# EAGLE design Mainboard (EAGLE 6.4)
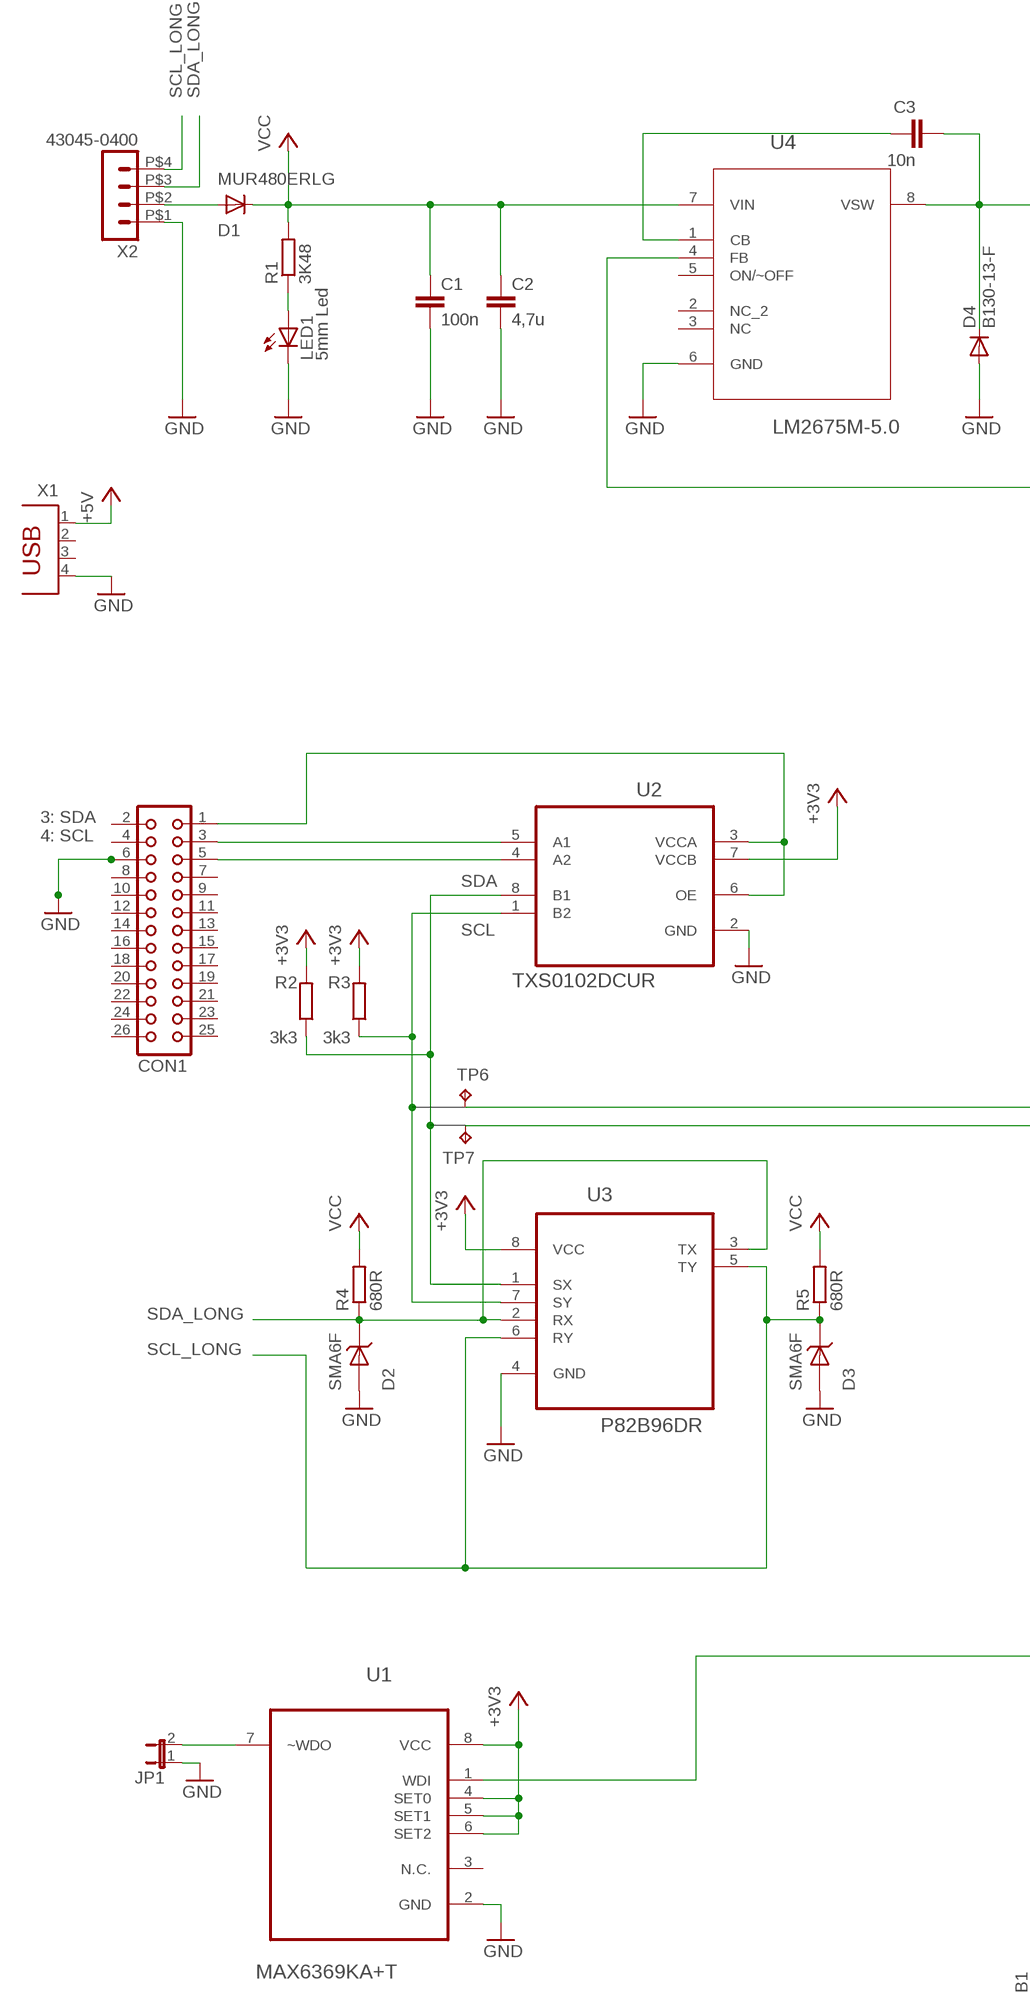
[diagram p0: schematic, sheet 1, part 1 of 2]
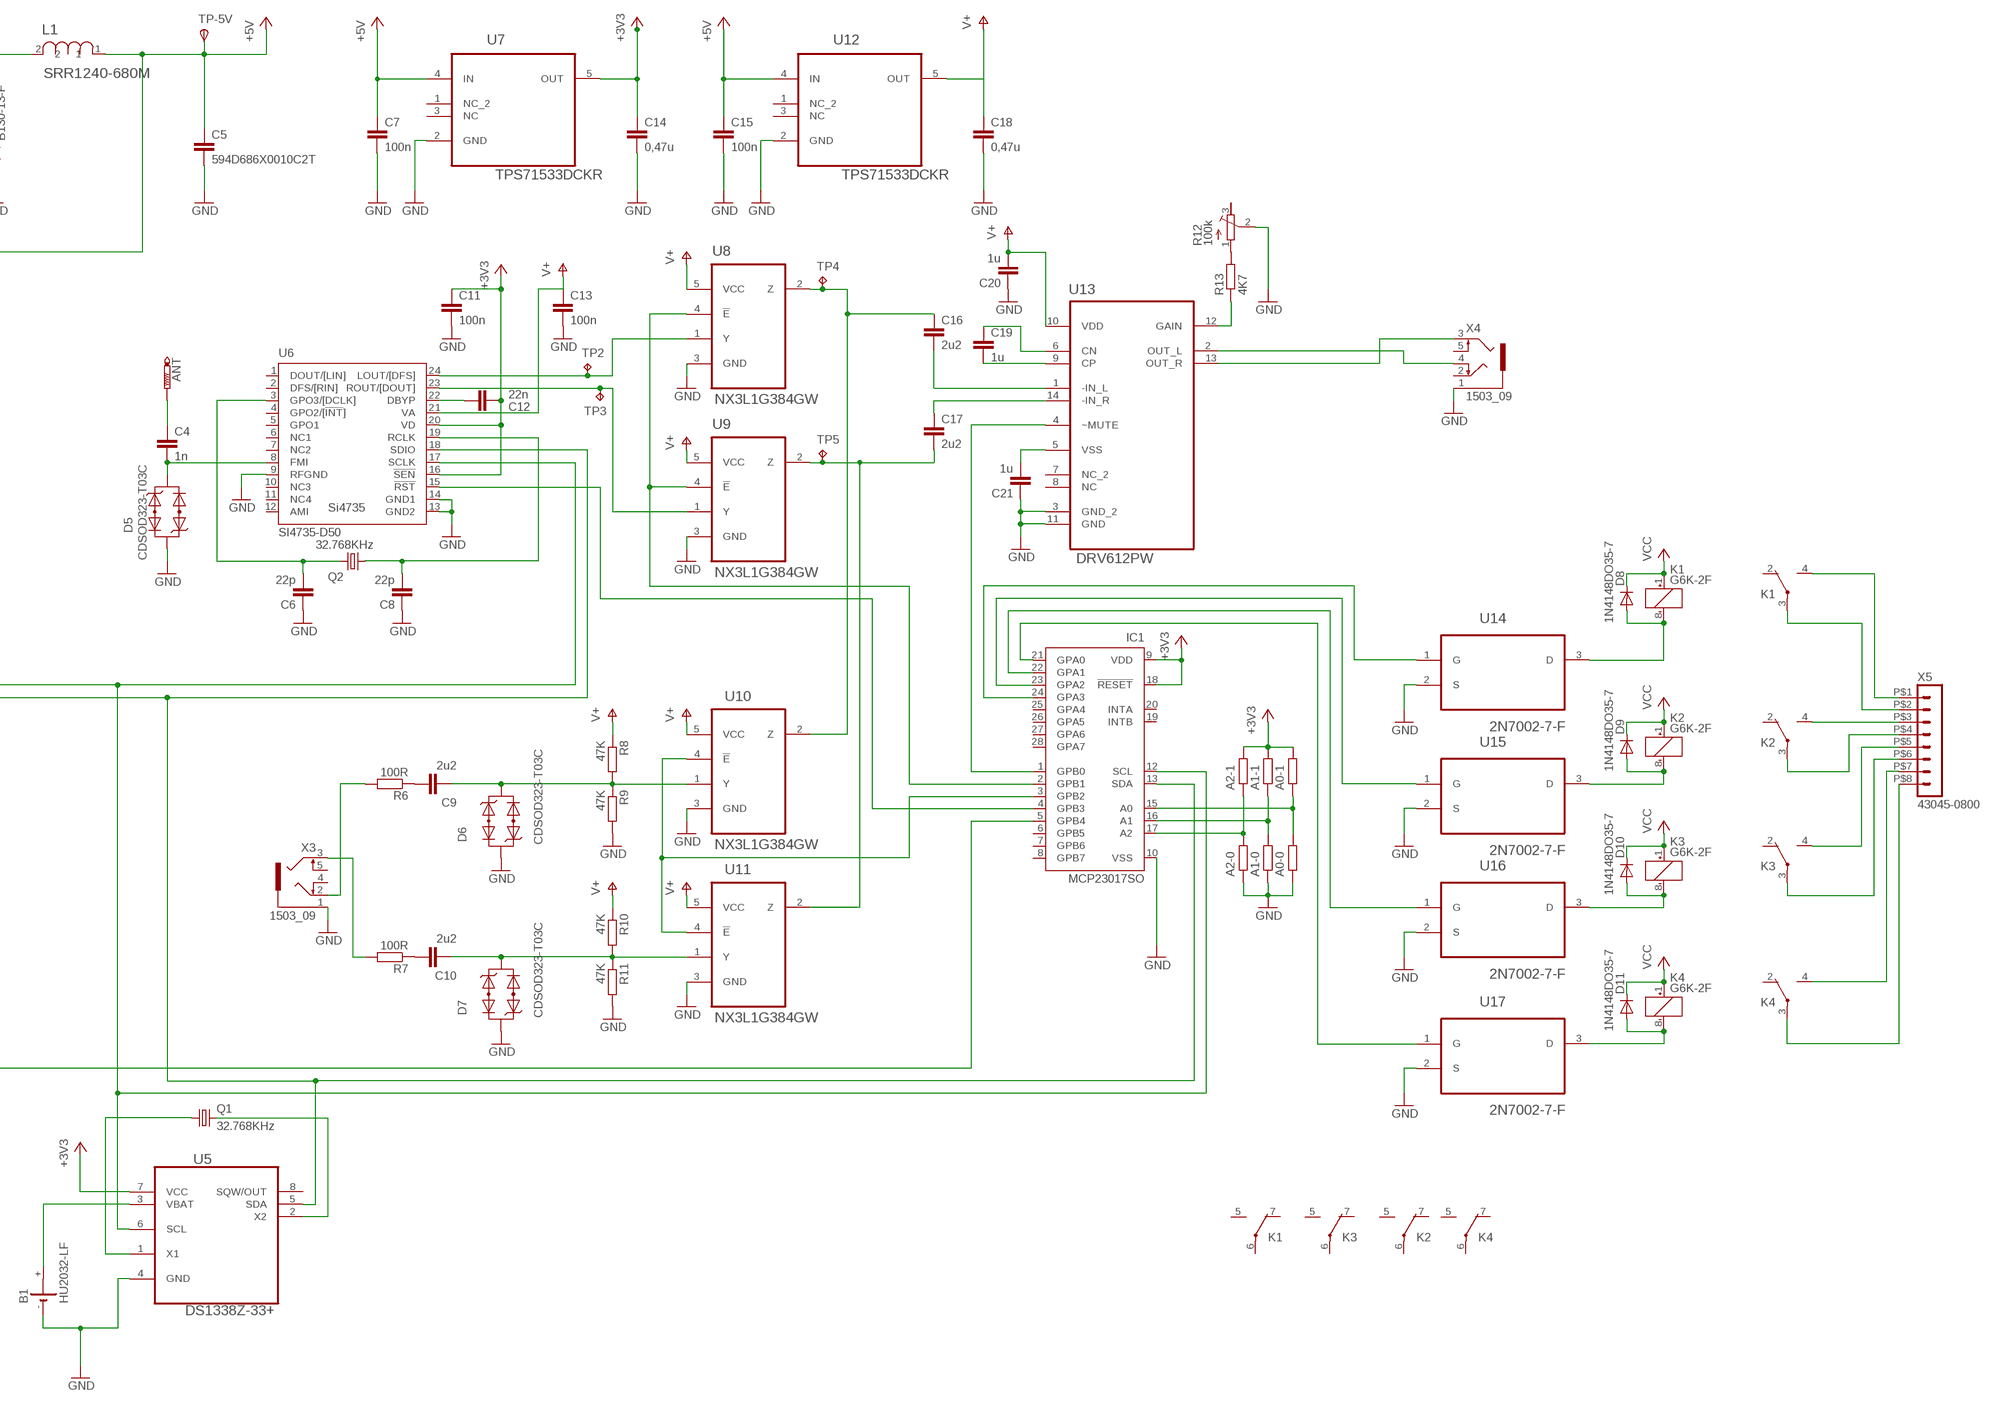
[diagram p1: schematic, sheet 1, part 2 of 2]

## Parts
ANT  PTR1PAD1-13  [P1-13]
B1  HU2032-LF  [HU2032-LF]
C1  100n  C-EUC0805  [C0805]
C2  4,7u  C-EUC1206  [C1206]
C3  10n  C-EUC0805  [C0805]
C4  1n  C-EUC0402  [C0402]
C5  594D686X0010C2T  [594D-B]
C6  22p  C-EUC0402  [C0402]
C7  100n  C-EUC0805  [C0805]
C8  22p  C-EUC0402  [C0402]
C9  2u2  C-EUC0805  [C0805]
C10  2u2  C-EUC0805  [C0805]
C11  100n  C-EUC0805  [C0805]
C12  22n  C-EUC0805  [C0805]
C13  100n  C-EUC0805  [C0805]
C14  0,47u  C-EUC0805  [C0805]
C15  100n  C-EUC0805  [C0805]
C16  2u2  C-EUC0805  [C0805]
C17  2u2  C-EUC0805  [C0805]
C18  0,47u  C-EUC0805  [C0805]
C19  1u  C-EUC1005  [C1005]
C20  1u  C-EUC1005  [C1005]
C21  1u  C-EUC1005  [C1005]
CON1  CON26  [CON26]
D1  MUR480ERLG  MUR150RL  [DO41-10]
D2  SMA6F  [DO-221AC]
D3  SMA6F  [DO-221AC]
D4  B130-13-F  DIODE-DO-214AC  [DO-214AC]
D5  CDSOD323-T03C  [SOD323]
D6  CDSOD323-T03C  [SOD323]
D7  CDSOD323-T03C  [SOD323]
D8  1N4148DO35-7  [DO35-7]
D9  1N4148DO35-7  [DO35-7]
D10  1N4148DO35-7  [DO35-7]
D11  1N4148DO35-7  [DO35-7]
IC1  MCP23017SO  [SO28W]
JP1  JP1E  [JP1]
K1  G6K-2F  [G6K-2F]
K2  G6K-2F  [G6K-2F]
K3  G6K-2F  [G6K-2F]
K4  G6K-2F  [G6K-2F]
L1  SRR1240-680M  [SRR1240]
LED1  5mm Led  LED5MM  [LED5MM]
Q1  32.768KHz  CRYSTALTC26V  [TC26V]
Q2  32.768KHz  CRYSTALTC26V  [TC26V]
R1  3K48  R-EU_0204/7  [0204/7]
R2  3k3  R-EU_0204/5  [0204/5]
R3  3k3  R-EU_0204/5  [0204/5]
R4  680R  R-EU_0204/2V  [0204V]
R5  680R  R-EU_0204/2V  [0204V]
R6  100R  R-EU_0204/2V  [0204V]
R7  100R  R-EU_0204/2V  [0204V]
R8  47K  R-EU_0204/2V  [0204V]
R9  47K  R-EU_0204/2V  [0204V]
R10  47K  R-EU_0204/2V  [0204V]
R11  47K  R-EU_0204/2V  [0204V]
R12  100k  R-TRIMM4G/J  [RTRIM4G/J]
R13  4K7  R-EU_0204/2V  [0204V]
R14  A2-1  R-EU_R0402  [R0402]
R15  A2-0  R-EU_R0402  [R0402]
R16  A1-1  R-EU_R0402  [R0402]
R17  A1-0  R-EU_R0402  [R0402]
R18  A0-1  R-EU_R0402  [R0402]
R19  A0-0  R-EU_R0402  [R0402]
TP2  TPTP07SQ  [TP07SQ]
TP3  TPTP07SQ  [TP07SQ]
TP4  TPTP07SQ  [TP07SQ]
TP5  TPTP07SQ  [TP07SQ]
TP6  TPTP07SQ  [TP07SQ]
TP7  TPTP07SQ  [TP07SQ]
TP-5V  TPSTP10SQ  [TP10SQ]
U1  MAX6369KA+T  [SOT65P280X145-8N]
U2  TXS0102DCUR  [SOP50P310X90-8N]
U3  P82B96DR  [SOIC127P600X175-8N]
U4  LM2675M-5.0  [SOIC127P620X175-8N]
U5  DS1338Z-33+  [SOIC127P600X175-8N]
U6  SI4735-D50  [SSOP24]
U7  TPS71533DCKR  [SOT65P210X110-5N]
U8  NX3L1G384GW  [SOT65P212X110-5N]
U9  NX3L1G384GW  [SOT65P212X110-5N]
U10  NX3L1G384GW  [SOT65P212X110-5N]
U11  NX3L1G384GW  [SOT65P212X110-5N]
U12  TPS71533DCKR  [SOT65P210X110-5N]
U13  DRV612PW  [SOP65P640X120-14N]
U14  2N7002-7-F  [SOT103P240X110-3N]
U15  2N7002-7-F  [SOT103P240X110-3N]
U16  2N7002-7-F  [SOT103P240X110-3N]
U17  2N7002-7-F  [SOT103P240X110-3N]
X1  PN87520  [PN87520]
X2  43045-0400  HEADER_POS4_43045-0401  [43045-0400]
X3  1503_09  [1503_09]
X4  1503_09  [1503_09]
X5  43045-0800  HEADER_POS8_43045-0800  [43045-0800]

## Nets
3V3A: C13.1 C18.1 C20.2 R8.1 R10.1 U6.21(VA) U8.5(VCC) U9.5(VCC) U10.5(VCC) U11.5(VCC) U12.5(OUT) U13.10(VDD) ; supply symbol labelled V+
+3V3 [Normal Bcc]: C11.1 C12.1 C14.1 IC1.9(VDD) IC1.18(!RESET) R2.2 R3.2 R14.2 R16.2 R18.2 U1.4(SET0) U1.5(SET1) U1.6(SET2) U1.8(VCC) U2.7(VCCB) U3.8(VCC) U5.7(VCC) U6.16(!SEN) U6.20(VD) U7.5(OUT)
+5V [Big Vcc]: C5.P$1 C7.1 C15.1 L1.1 TP-5V.TP(PP) U4.4(FB) U7.4(IN) U12.4(IN) X1.1
GND: B1.- C1.2 C2.2 C5.P$2 C6.1 C7.2 C8.1 C11.2 C13.2 C14.2 C15.2 C18.2 C20.1 C21.1 CON1.6 D2.AN D3.AN D4.A D5.P$1 D6.P$1 D7.P$1 IC1.10(VSS) JP1.1 LED1.K(C) R9.2 R11.2 R12.2(S) R15.1 R17.1 R19.1 U1.2(GND) U2.2(GND) U3.4(GND) U4.6(GND) U5.4(GND) U6.9(RFGND) U6.13(GND2) U6.14(GND1) U7.2(GND) U8.3(GND) U9.3(GND) U10.3(GND) U11.3(GND) U12.2(GND) U13.3(GND_2) U13.11(GND) U14.2(S) U15.2(S) U16.2(S) U17.2(S) X1.4 X2.P$1 X3.1 X4.1
N$1 [Big Vcc]: D1.A X2.P$2
N$2: C6.2 Q2.1 U6.3(GPO3/[DCLK])
N$3: CON1.3 U2.5(A1)
N$4: IC1.13(SDA) TP7.TP U5.5(SDA) U6.18(SDIO)
N$5: K1.4(2:S) X5.P$1
N$6: CON1.5 U2.4(A2)
N$7: IC1.21(GPA0) U17.1(G)
N$8: CON1.1 U2.3(VCCA) U2.6(OE)
N$9: D11.A K4.8(1:-) U17.3(D)
N$10: C3.1 U4.1(CB)
N$11 [Big Vcc]: C3.2 D4.C L1.2 U4.8(VSW)
N$12: K4.4(2:S) X5.P$7
N$13: K4.3(2:P) X5.P$8
N$14: R2.1 U2.8(B1) U3.1(SX)
N$15: Q1.2 U5.2(X2)
N$16: B1.+ U5.3(VBAT)
N$17: Q1.1 U5.1(X1)
N$18: IC1.24(GPA3) U14.1(G)
N$19: IC1.23(GPA2) U15.1(G)
N$20: K1.3(2:P) X5.P$2
N$21: IC1.22(GPA1) U16.1(G)
N$22: D8.A K1.8(1:-) U14.3(D)
N$23: D9.A K2.8(1:-) U15.3(D)
N$24: D10.A K3.8(1:-) U16.3(D)
N$27: TP2.TP U6.24(LOUT/[DFS]) U8.1(Y)
N$28: TP3.TP U6.23(ROUT/[DOUT]) U9.1(Y)
N$29: C16.1 TP4.TP U8.2(Z) U10.2(Z)
N$30: C17.2 TP5.TP U9.2(Z) U11.2(Z)
N$31: IC1.3(GPB2) U10.4(!E) U11.4(!E)
N$32: C8.2 Q2.2 U6.19(RCLK)
N$33: IC1.5(GPB4) U1.1(WDI)
N$35: IC1.4(GPB3) U6.15(!RST)
N$36: C10.2 D7.P$2 R10.2 R11.1 U11.1(Y)
N$37: C9.2 D6.P$2 R8.2 R9.1 U10.1(Y)
N$38: IC1.1(GPB0) U13.4(~MUTE)
N$39: LED1.A R1.1
N$40: U13.2(OUT_L) X4.4
N$41: IC1.15(A0) R18.1 R19.2
N$42: IC1.16(A1) R16.1 R17.2
N$43: IC1.17(A2) R14.1 R15.2
N$44: U13.13(OUT_R) X4.3
N$45: R12.1(E) R13.2
N$46: R13.1 U13.12(GAIN)
N$47: R6.2 X3.2
N$48: C9.1 R6.1
N$49: R7.2 X3.3
N$50: C10.1 R7.1
N$51: JP1.2 U1.7(~WDO)
N$52: K2.4(2:S) X5.P$3
N$53: C16.2 U13.1(-IN_L)
N$54: C19.2 U13.9(CP)
N$55: C17.1 U13.14(-IN_R)
N$56: C19.1 U13.6(CN)
N$57: C21.2 U13.5(VSS)
N$58: ANT.TP C4.1
N$59: C4.2 D5.P$2 U6.8(FMI)
N$60: K2.3(2:P) X5.P$4
N$61: C12.2 U6.22(DBYP)
N$62: IC1.12(SCL) TP6.TP U5.6(SCL) U6.17(SCLK)
N$63: K3.4(2:S) X5.P$5
N$64: K3.3(2:P) X5.P$6
N$65: R3.1 U2.1(B2) U3.7(SY)
N$66: IC1.2(GPB1) U8.4(!E) U9.4(!E)
SCL_LONG: D3.KAT R5.1 U3.5(TY) U3.6(RY) X2.P$4
SDA_LONG: D2.KAT R4.1 U3.2(RX) U3.3(TX) X2.P$3
VCC [Big Vcc]: C1.1 C2.1 D1.C D8.C D9.C D10.C D11.C K1.1(1:+) K2.1(1:+) K3.1(1:+) K4.1(1:+) R1.2 R4.2 R5.2 U4.7(VIN)
Unconnected: B1.+@1(+) CON1.2 CON1.4 CON1.7 CON1.8 CON1.9 CON1.10 CON1.11 CON1.12 CON1.13 CON1.14 CON1.15 CON1.16 CON1.17 CON1.18 CON1.19 CON1.20 CON1.21 CON1.22 CON1.23 CON1.24 CON1.25 CON1.26 IC1.6(GPB5) IC1.7(GPB6) IC1.8(GPB7) IC1.19(INTB) IC1.20(INTA) IC1.25(GPA4) IC1.26(GPA5) IC1.27(GPA6) IC1.28(GPA7) K1.2(2:O) K1.5(3:S) K1.6(3:P) K1.7(3:O) K2.2(2:O) K2.5(3:S) K2.6(3:P) K2.7(3:O) K3.2(2:O) K3.5(3:S) K3.6(3:P) K3.7(3:O) K4.2(2:O) K4.5(3:S) K4.6(3:P) K4.7(3:O) R12.3(A) U1.3(N.C.) U4.2(NC_2) U4.3(NC) U4.5(ON/~OFF) U5.8(SQW/OUT) U6.1(DOUT/[LIN]) U6.2(DFS/[RIN]) U6.4(GPO2/[!INT!]) U6.5(GPO1) U6.6(NC1) U6.7(NC2) U6.10(NC3) U6.11(NC4) U6.12(AMI) U7.1(NC_2) U7.3(NC) U12.1(NC_2) U12.3(NC) U13.7(NC_2) U13.8(NC) X1.2 X1.3 X3.4 X3.5 X4.2 X4.5

## Notes on the sheet
- 3: SDA
  4: SCL
- SDA
- SCL

## Library data of the parts
ANT = testpad:PTR1: TEST PIN
B1 = MyComponents:HU2032-LF
C1-C4 C6-C21 = rcl:C-EU: CAPACITOR, European symbol
C5 = MyComponents:594D686X0010C2T
CON1 = con-harting:CON26: CONNECTOR; OC_FARNELL: unknown; OC_NEWARK: unknown
D1 = diode:MUR150RL: DIODE
D2 D3 = MyComponents:SMA6F
D4 = diode:DIODE-: DIODE
D5-D7 = MyComponents:CDSOD323-T03C
D8-D11 = diode:1N4148: DIODE high speed (Philips)
IC1 = Microchip:MCP23017: http://ww1.microchip.com/downloads/en/DeviceDoc/21952a.pdf Source: http://ww1.microchip.com/downloads/en/DeviceDoc/21952a.pdf; MF: MICROCHIP; MPN: MCP23017-E/SO; OC_FARNELL: 1332087; OC_NEWARK: 31K2958
JP1 = jumper:JP1E: JUMPER
K1-K4 = relay:G6K: Low Signal Relay oeiwcsnts1.omron.com/.. D20G6K0100.pdf; MF: OMRON COMPONENTS USA; MPN: G6K-2F DC24; OC_FARNELL: 1690427; OC_NEWARK: 36K7467
L1 = Bourns_By_element14_Batch_1:SRR1240-680M
LED1 = led:LED: LED OSRAM: - CHIPLED LG R971, LG N971, LY N971, LG Q971, LY Q971, LO R971, LY R971 LH N974, LH R974 LS Q976, LO Q976, LY Q976 LO Q996 - Hyper CHIPLED LW Q18S LB Q993, LB Q99A, LB R99A - SideLED LS A670, LO A670, LY A670, LG A670, LP A670 LB A673, LV A673, LT A673, LW A673 LH A674 LY A675 LS A676, LA A676, LO A676, LY A676, LW A676 LS A679, LY A679, LG A679 - Hyper Micro SIDELED® LS Y876, LA Y876, LO Y876, LY Y876 LT Y87S - SmartLED LW L88C, LW L88S LB L89C, LB L89S, LG L890 LS L89K, LO L89K, LY L89K LS L896, LA L896, LO L896, LY L896 - TOPLED LS T670, LO T670, LY T670, LG T670, LP T670 LSG T670, LSP T670, LSY T670, LOP T670, LYG T670 LG T671, LOG T671, LSG T671 LB T673, LV T673, LT T673, LW T673 LH T674 LS T676, LA T676, LO T676, LY T676, LB T676, LH T676, LSB T676, LW T676 LB T67C, LV T67C, LT T67C, LS T67K, LO T67K, LY T67K, LW E67C LS E67B, LA E67B, LO E67B, LY E67B, LB E67C, LV E67C, LT E67C LW T67C LS T679, LY T679, LG T679 LS T770, LO T770, LY T770, LG T770, LP T770 LB T773, LV T773, LT T773, LW T773 LH T774 LS E675, LA E675, LY E675, LS T675 LS T776, LA T776, LO T776, LY T776, LB T776 LHGB T686 LT T68C, LB T68C - Hyper Mini TOPLED® LB M676 - Mini TOPLED Santana® LG M470 LS M47K, LO M47K, LY M47K Source: http://www.osram.convergy.de LUXEON: - LUMILED® LXK2-PW12-R00, LXK2-PW12-S00, LXK2-PW14-U00, LXK2-PW14-V00 LXK2-PM12-R00, LXK2-PM12-S00, LXK2-PM14-U00 LXK2-PE12-Q00, LXK2-PE12-R00, LXK2-PE12-S00, LXK2-PE14-T00, LXK2-PE14-U00 LXK2-PB12-K00, LXK2-PB12-L00, LXK2-PB12-M00, LXK2-PB14-N00, LXK2-PB14-P00, LXK2-PB14-Q00 LXK2-PR12-L00, LXK2-PR12-M00, LXK2-PR14-Q00, LXK2-PR14-R00 LXK2-PD12-Q00, LXK2-PD12-R00, LXK2-PD12-S00 LXK2-PH12-R00, LXK2-PH12-S00 LXK2-PL12-P00, LXK2-PL12-Q00, LXK2-PL12-R00 Source: www.luxeon.com KINGBRIGHT: KA-3528ASYC Source: www.kingbright.com
Q1 Q2 = crystal:CRYSTAL: CRYSTAL; OC_FARNELL: unknown; OC_NEWARK: unknown
R1 = rcl:R-EU_: RESISTOR, European symbol
R2-R11 R13-R19 = resistor:R-EU_: RESISTOR, European symbol
R12 = resistor:R-TRIMM: Trimm resistor
TP2-TP7 = testpad:TP: Test pad
TP-5V = testpad:TPS: TEST PIN
U1 = Maxim_By_element14_Batch_1:MAX6369KA+T: Pin-Selectable Watchdog Timers; MPN: MAX6369KA+T; OC_FARNELL: 1787051; OC_NEWARK: 68K9450; PACKAGE: SOT23-8; SUPPLIER: Maxim
U2 = Texas:TXS0102DCUR: 2-BIT BIDIRECTIONAL VOLTAGE-LEVEL TRANSLATOR FOR OPEN-DRAIN AND PUSH-PULL APPLICATIONS; MPN: TXS0102DCUR; OC_FARNELL: 1703315; OC_NEWARK: 30M1878; PACKAGE: SOP-8; SUPPLIER: Texas Instruments
U3 = Texas:P82B96DR: DUAL BIDIRECTIONAL BUS BUFFER; MPN: P82B96DR; OC_FARNELL: 1576671; OC_NEWARK: 88K6385; PACKAGE: SOIC-8; SUPPLIER: Texas Instruments
U4 = Texas:LM2675M-5.0: Step-Down Voltage Regulator; MPN: LM2675M-5.0; OC_FARNELL: 9489746; OC_NEWARK: 41K4141; PACKAGE: 8-SOIC; SUPPLIER: National Semiconductors
U5 = Maxim_By_element14_Batch_1:DS1338Z-33+: I2C RTC with 56-Byte NV RAM; MPN: DS1338Z-33+; OC_FARNELL: 1379714; OC_NEWARK: 27K7425; PACKAGE: SOIC-8; SUPPLIER: Maxim
U6 = SiliconLabs:SI4735-D50
U7 U12 = Texas:TPS71533DCKR: Linear Regulator; MPN: TPS71533DCKR; OC_FARNELL: 1135383; OC_NEWARK: 77C0815; PACKAGE: SC-70-5; SUPPLIER: Texas Instruments
U8-U11 = NXP_By_element14_Batch_1:NX3L1G384GW: Low-ohmic single-pole single-throw analog switch,TSSOP-5; MPN: NX3L1G384GW; OC_FARNELL: 2164820; OC_NEWARK: 55W4258; PACKAGE: TSSOP-5(SOT); SUPPLIER: NXP
U13 = Texas:DRV612PW: Line Driver With Programmable-Fixed Gain; MPN: DRV612PW; OC_FARNELL: 1882273; OC_NEWARK: 27T6360; PACKAGE: TSSOP-14; SUPPLIER: Texas Instruments
U14-U17 = Diodes:2N7002-7-F: N-CHANNEL ENHANCEMENT MODE FIELD EFFECT TRANSISTOR; MPN: 2N7002-7-F; OC_FARNELL: 1713823; OC_NEWARK: 25R5679; PACKAGE: SOT-23-3; SUPPLIER: DIODES INC.
X1 = con-berg:PN87520: BERG USB connector; OC_FARNELL: unknown; OC_NEWARK: unknown
X2 = con-molex-micro-fit-3_0:HEADER_POS4_?: Molex - Micro-Fit 3.0 Series connector, 3.00mm (0.118") pitch header, 4 positions.
X3 X4 = con-lumberg:1503_09: Jack connectors according to JISC 6560, 3.5 mm Klinkeneinbaukupplung nach JISC 6560, 3,5 mm, 3-polig/ stereo, abgewinkelte Ausführung, mit 2 Öffnern und Lötaugen, für Leiterplatten Rückseitenmontage Source: http://www.lumberg.com/Produkte/PDFs/1503_09.pdf; OC_FARNELL: 1243244; OC_NEWARK: unknown
X5 = con-molex-micro-fit-3_0:HEADER_POS8_?: Molex - Micro-Fit 3.0 Series connector, 3.00mm (0.118") pitch header, 8 positions.

## Net classes
0 default: width 0.254 mm, clearance 0.254 mm
1 Normal Bcc: width 0.254 mm, clearance 0.254 mm
2 Big Vcc: width 0.762 mm, clearance 0.254 mm
3 LED Current: width 0.381 mm, clearance 0.254 mm

## Board
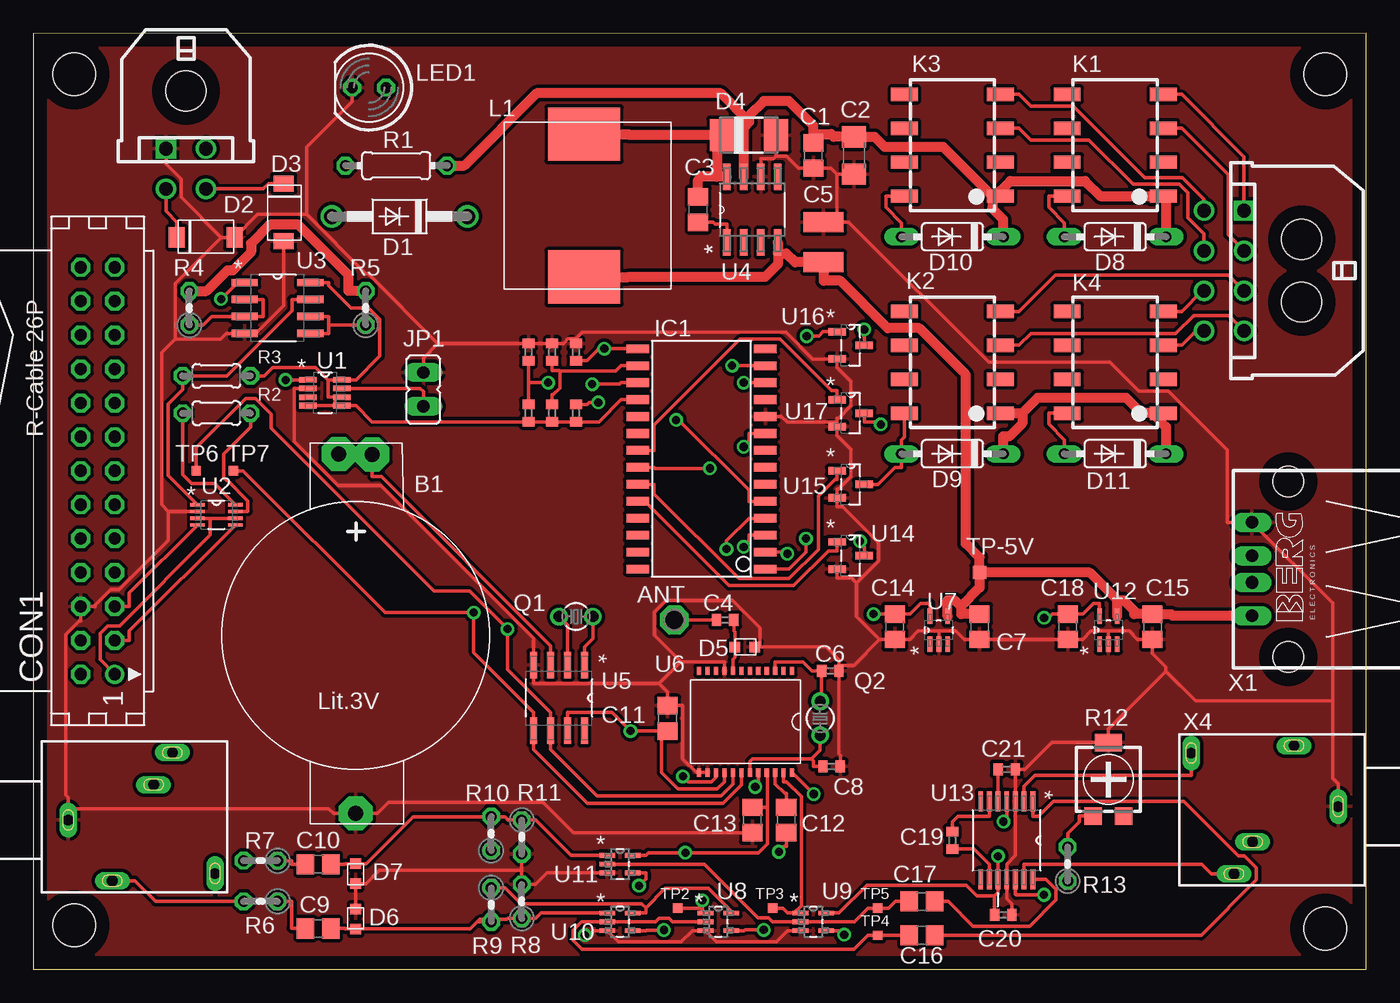
[diagram p2: board, top side]
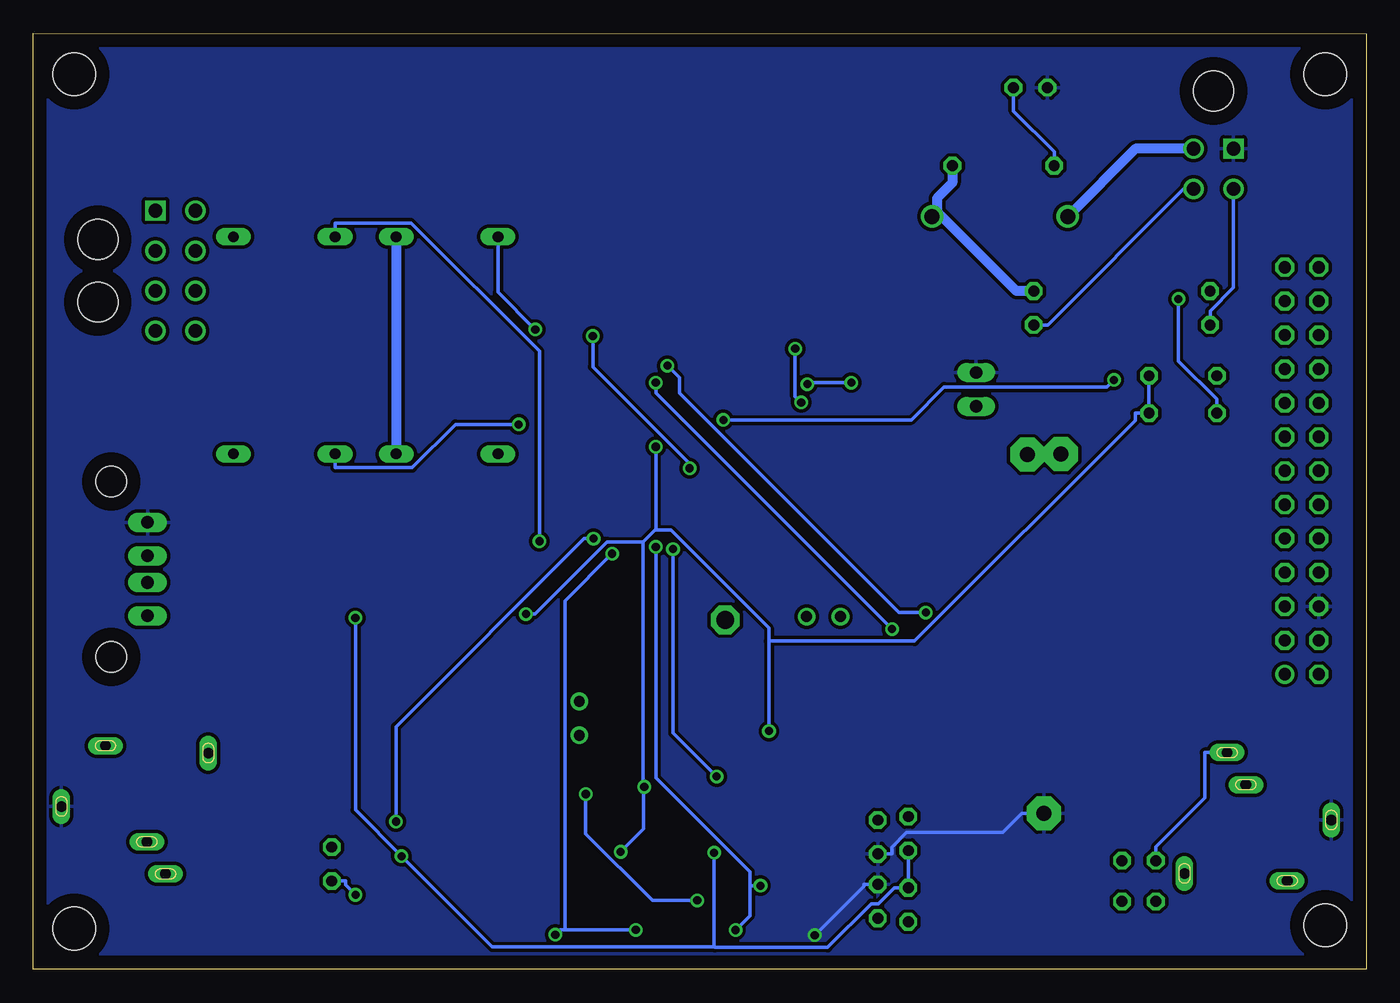
[diagram p3: board, bottom side, seen from below]

Size 99.82 x 70.1 mm. Coordinates in mm from the lower left corner, seen from the top.
Outline: 0,0 99.82,0 99.82,70.1 0,70.09 0,0
Copper layers (1*16): Top 0.035mm / dielectric 1.5mm / Bottom 0.035mm
Design rules "default *": minimum track width 10mil, minimum drill 24mil, track to track 10mil, track to pad 10mil, pad to pad 10mil, via to via 10mil, smd to smd 10mil, copper to edge 40mil, drill to drill 8mil, minimum pad ring 10mil, minimum via ring 8mil, stop-mask expansion 4mil, vias tented up to drill 0mil, thermal gap 10mil
Holes 3.2 mm at 96.77,3.05 96.77,67.06 3.05,3.3 3.05,67.06

### Footprints (pad centres in the part's own frame; a part is rotated, then mirrored left to right if it is on the bottom)
P1-13 = drill 1.321 pad 2.159 octagon: TP 0,0
HU2032-LF = drill 1.118 pad 2.54 octagon: + 1.25,13.145; +@1 -1.27,13.185; - 0,-13.73
C0805 = smd 1.3 x 1.5: 1 -0.95,0; 2 0.95,0
C1206 = smd 1.6 x 1.8: 1 -1.4,0; 2 1.4,0
C0402 = smd 0.7 x 0.9: 1 -0.65,0; 2 0.65,0
594D-B = smd 3 x 1.5: P$1 0,-1.4; P$2 0,1.6
C1005 = smd 0.7 x 0.9: 1 -0.65,0; 2 0.65,0
CON26 = drill 0.914: 1 -15.24,-1.27 | drill 0.914 octagon: 2 -15.24,1.27; 3 -12.7,-1.27; 4 -12.7,1.27; 5 -10.16,-1.27; 6 -10.16,1.27; 7 -7.62,-1.27; 8 -7.62,1.27; 9 -5.08,-1.27; 10 -5.08,1.27; 11 -2.54,-1.27; 12 -2.54,1.27; 13 0,-1.27; 14 0,1.27; 15 2.54,-1.27; 16 2.54,1.27; 17 5.08,-1.27; 18 5.08,1.27; 19 7.62,-1.27; 20 7.62,1.27; 21 10.16,-1.27; 22 10.16,1.27; 23 12.7,-1.27; 24 12.7,1.27; 25 15.24,-1.27; 26 15.24,1.27
DO41-10 = drill 1.118: A 5.08,0; C -5.08,0
DO-221AC = smd 1.2 x 1.52: AN 2.11,-0.05; KAT -2.21,-0.05
DO-214AC = smd 1.8 x 2.4: A 2.025,0; C -2.025,0
SOD323 = smd 0.8 x 0.8: P$1 0.7,0; P$2 -0.8,0
DO35-7 = drill 0.813 long: A 3.81,0; C -3.81,0
SO28W = smd 0.65 x 1.7: 1 -7.62,-4.78; 2 -6.35,-4.78; 3 -5.08,-4.78; 4 -3.81,-4.78; 5 -2.54,-4.78; 6 -1.27,-4.78; 7 0,-4.78; 8 1.27,-4.78; 9 2.54,-4.78; 10 3.81,-4.78; 11 5.08,-4.78; 12 6.35,-4.78; 13 7.62,-4.78; 14 8.89,-4.78; 15 8.89,4.78; 16 7.62,4.78; 17 6.35,4.78; 18 5.08,4.78; 19 3.81,4.78; 20 2.54,4.78; 21 1.27,4.78; 22 0,4.78; 23 -1.27,4.78; 24 -2.54,4.78; 25 -3.81,4.78; 26 -5.08,4.78; 27 -6.35,4.78; 28 -7.62,4.78
JP1 = drill 0.914 long: 1 0,-1.27; 2 0,1.27
G6K-2F = smd 1 x 2: 1 -3.81,-3.6; 2 -1.27,-3.6; 3 1.27,-3.6; 4 3.81,-3.6; 5 3.81,3.6; 6 1.27,3.6; 7 -1.27,3.6; 8 -3.81,3.6
SRR1240 = smd 4 x 5.4: 1 -5.3,-0.1; 2 5.4,-0.1
LED5MM = drill 0.813 octagon: A -1.27,0; K 1.27,0
TC26V = drill 0.813: 1 -1.27,0; 2 1.27,0
0204/7 = drill 0.813 octagon: 1 -3.81,0; 2 3.81,0
0204/5 = drill 0.813 octagon: 1 -2.54,0; 2 2.54,0
0204V = drill 0.813 octagon: 1 -1.27,0; 2 1.27,0
RTRIM4G/J = smd 1.3 x 1.3: 1 -1.15,-2.75; 3 1.15,-2.75 | smd 2 x 1.3: 2 0,2.75
R0402 = smd 0.7 x 0.9: 1 -0.65,0; 2 0.65,0
TP07SQ = smd 0.7 x 0.7: TP 0,0
TP10SQ = smd 1 x 1: TP 0,0
SOT65P280X145-8N = smd 1.321 x 0.432: 1 -1.27,0.965; 2 -1.27,0.33; 3 -1.27,-0.33; 4 -1.27,-0.965; 5 1.27,-0.965; 6 1.27,-0.33; 7 1.27,0.33; 8 1.27,0.965
SOP50P310X90-8N = smd 1.067 x 0.254: 1 -1.422,0.762; 2 -1.422,0.254; 3 -1.422,-0.254; 4 -1.422,-0.762; 5 1.422,-0.762; 6 1.422,-0.254; 7 1.422,0.254; 8 1.422,0.762
SOIC127P600X175-8N = smd 1.981 x 0.559: 1 -2.464,1.905; 2 -2.464,0.635; 3 -2.464,-0.635; 4 -2.464,-1.905; 5 2.464,-1.905; 6 2.464,-0.635; 7 2.464,0.635; 8 2.464,1.905
SOIC127P620X175-8N = smd 1.981 x 0.559: 1 -2.464,1.905; 2 -2.464,0.635; 3 -2.464,-0.635; 4 -2.464,-1.905; 5 2.464,-1.905; 6 2.464,-0.635; 7 2.464,0.635; 8 2.464,1.905
SOIC127P600X175-8N' = smd 1.981 x 0.533: 1 -2.464,1.905; 2 -2.464,0.635; 3 -2.464,-0.635; 4 -2.464,-1.905; 5 2.464,-1.905; 6 2.464,-0.635; 7 2.464,0.635; 8 2.464,1.905
SSOP24 = smd 0.305 x 0.61: 1 -4.763,-2.54; 2 -4.128,-2.54; 3 -3.493,-2.54; 4 -2.857,-2.54; 5 -2.223,-2.54; 6 -1.587,-2.54; 7 -0.953,-2.54; 8 -0.318,-2.54; 9 0.318,-2.54; 10 0.953,-2.54; 11 1.587,-2.54; 12 2.223,-2.54; 13 2.223,5.08; 14 1.587,5.08; 15 0.953,5.08; 16 0.318,5.08; 17 -0.318,5.08; 18 -0.953,5.08; 19 -1.587,5.08; 20 -2.223,5.08; 21 -2.857,5.08; 22 -3.493,5.08; 23 -4.128,5.08; 24 -4.763,5.08
SOT65P210X110-5N = smd 1.168 x 0.356: 1 -1.041,0.66; 2 -1.041,0; 3 -1.041,-0.66; 4 1.041,-0.66; 5 1.041,0.66
SOT65P212X110-5N = smd 1.168 x 0.356: 1 -0.965,0.66; 2 -0.965,0; 3 -0.965,-0.66; 4 0.965,-0.66; 5 0.965,0.66
SOP65P640X120-14N = smd 1.473 x 0.356: 1 -2.921,1.956; 2 -2.921,1.295; 3 -2.921,0.66; 4 -2.921,0; 5 -2.921,-0.66; 6 -2.921,-1.295; 7 -2.921,-1.956; 8 2.921,-1.956; 9 2.921,-1.295; 10 2.921,-0.66; 11 2.921,0; 12 2.921,0.66; 13 2.921,1.295; 14 2.921,1.956
SOT103P240X110-3N = smd 1.321 x 0.559: 1 -1.016,1.016; 2 -1.016,-1.016; 3 1.016,0
PN87520 = drill 0.95 long: 1 -3.5,2.71; 2 -1,2.71; 3 1,2.71; 4 3.5,2.71 | hole 2.3: -6.57,0; 6.57,0
43045-0400 = drill 1.02 square: P$1 1.5,4.32 | drill 1.02: P$2 -1.5,4.32; P$3 1.5,7.32; P$4 -1.5,7.32 | hole 3: 0,0
1503_09 = drill 0.8 pad 1.2 long: 1 0,-2.1; 2 -4.55,-5.4; 3 5.05,-9.9; 4 -4,-13.1; 5 2.65,-8.5
43045-0800 = drill 1.02 square: P$1 4.5,4.32 | drill 1.02: P$2 1.5,4.32; P$3 -1.5,4.32; P$4 -4.5,4.32; P$5 4.5,7.32; P$6 1.5,7.32; P$7 -1.5,7.32; P$8 -4.5,7.32 | hole 3: 2.35,0; -2.35,0

### Placement (x,y rotation side)
ANT  48.01,26.16 0 top
B1  24.13,25.4 0 top
C1  58.42,60.96 270 top
C2  61.47,60.96 270 top
C3  49.78,56.9 90 top
C4  51.82,26.16 0 top
C5  59.18,54.36 0 top
C6  59.69,22.35 180 top
C7  70.87,25.65 270 top
C8  59.79,15.19 180 top
C9  21.34,3.05 0 top
C10  21.34,7.87 0 top
C11  47.5,18.8 90 top
C12  56.39,11.18 90 top
C13  53.85,11.18 270 top
C14  64.52,25.65 270 top
C15  83.82,25.65 270 top
C16  66.55,2.54 0 top
C17  66.55,5.08 180 top
C18  77.47,25.65 270 top
C19  68.83,9.65 270 top
C20  72.64,4.06 180 top
C21  72.9,14.99 180 top
CON1  4.83,37.34 90 top
D1  27.43,56.39 180 top
D2  12.95,54.86 0 top
D3  18.8,56.64 270 top
D4  53.59,62.48 0 top
D5  53.34,24.13 0 top
D6  24.13,3.81 90 top
D7  24.13,7.11 270 top
D8  81.03,54.86 180 top
D9  68.83,38.61 180 top
D10  68.83,54.86 180 top
D11  81.03,38.61 180 top
IC1  50.04,37.59 90 top
JP1  29.21,43.43 180 top
K1  81.03,61.72 90 top
K2  68.83,45.47 90 top
K3  68.83,61.72 90 top
K4  81.03,45.47 90 top
L1  41.15,57.15 90 top
LED1  25.15,66.04 180 top
Q1  40.64,26.42 180 top
Q2  58.93,18.8 270 top
R1  27.18,60.2 0 top
R2  13.72,41.66 0 top
R3  13.72,44.45 0 top
R4  11.68,49.53 90 top
R5  24.89,49.53 90 top
R6  17.02,5.08 180 top
R7  17.02,8.13 180 top
R8  34.29,4.83 270 top
R9  36.58,5.08 90 top
R10  34.29,10.16 90 top
R11  36.58,9.91 270 top
R12  80.52,14.22 0 top
R13  77.47,7.87 90 top
R14  37.08,41.66 270 top
R15  37.08,46.23 270 top
R16  38.86,41.66 270 top
R17  38.86,46.23 270 top
R18  40.64,41.66 270 top
R19  40.64,46.23 270 top
TP2  48.26,4.57 0 top
TP3  55.37,4.57 0 top
TP4  63.25,2.54 0 top
TP5  63.25,4.57 0 top
TP6  12.19,37.34 0 top
TP7  14.99,37.34 0 top
TP-5V  70.87,29.72 0 top
U1  21.84,43.18 0 top
U2  13.72,34.04 0 top
U3  18.29,49.53 0 top
U4  53.85,56.9 90 top
U5  DS1338Z-33+  [SOIC127P600X175-8N']  39.37,20.32 270 top
U6  52.07,19.81 180 top
U7  67.82,25.4 90 top
U8  51.31,3.56 0 top
U9  58.42,3.56 0 top
U10  43.94,3.56 0 top
U11  43.94,7.87 0 top
U12  80.52,25.4 90 top
U13  72.9,9.65 270 top
U14  61.21,30.99 0 top
U15  61.21,36.32 0 top
U16  61.21,46.74 0 top
U17  61.21,41.66 0 top
X1  93.98,29.97 90 top
X2  11.43,65.79 180 top
X3  0.51,11.18 90 top
X4  99.82,12.19 270 top
X5  95,52.32 90 top

### Tracks (layer width: path | path; a pad name or v marks a point on that pad's centre or on a via)
3V3A  (via drill 0.61 pad 1.02)
  Top 0.254: 45.87,4.59 45.87,4.22 U10.5 | 45.87,4.59 45.56,4.9 36.52,4.9 35.33,6.1 R8.1 | 45.87,4.59 47.33,6.05 50.55,6.05 52.27,4.32 U8.5 | 54.98,12.13 54.98,9.4 54.31,8.73 v48.84,8.73 46.07,8.73 45.87,8.53 U11.5 | 54.98,12.13 54.98,14.68 U6.21 | U9.5 60.35,4.22 62.42,6.29 69.87,6.29 70.65,5.5 71.99,5.5 | 71.99,5.5 72.1,5.61 72.24,5.61 U13.10 72.24,7.85 72.25,7.86 v72.25,8.47 | 71.99,5.5 71.99,4.89 C20.2 | v75.7,26.32 76.05,26.32 76.34,26.6 C18.1 78.6,26.6 79.4,27.41 79.86,27.41 U12.5 | C13.1 54.98,12.13
  Bottom 0.254: 48.84,1.68 v48.84,8.73 | 48.84,1.68 48.79,1.62 40.33,1.62 37.06,4.9 36.53,4.9 35.33,6.1 34.75,6.1 R8.1 R10.1 | 48.84,1.68 65.46,1.68 v72.25,8.47 75.7,11.92 v75.7,26.32
+3V3  (via drill 0.61 pad 1.02)
  Top 0.254: U7.5 67.16,27.41 66.45,27.41 65.65,26.6 C14.1 v62.93,26.6 | IC1.18 44.03,42.67 42.36,41.01 R18.2 R16.2 R14.2 25.36,41.01 24.16,42.22 U1.5 22.59,42.22 | v55.83,8.79 56.23,9.2 56.39,9.2 C12.1 | 22.59,42.22 22.07,42.22 21.62,42.22 U1.4 | 22.59,42.85 22.07,42.85 22.07,44.15 | U1.6 22.59,42.85 | 22.59,42.85 22.59,42.22 | 22.07,44.15 22.2,44.15 U1.8 24.16,44.15 25.93,45.92 25.93,48.71 25.11,49.53 23.79,49.53 22.12,51.2 22.12,51.44 U3.8 | R3.2 17.3,44.45 17.91,45.06 21.15,45.06 22.07,44.15 | v53.2,39.14 53.59,39.52 53.59,40.13 IC1.9 | 47.06,17.85 47.06,14.73 48.29,13.5 51.21,13.5 51.75,14.05 U6.16 | v54.07,13.66 54.29,13.88 U6.20 | R2.2 16.26,40.61 14.24,38.6 14.24,36.81 14.46,36.6 14.54,36.6 16.05,35.08 16.05,34.29 U2.7 | 47.06,17.85 46.37,17.85 v44.73,17.85 43.35,19.23 40.01,19.23 U5.7 | C11.1 47.06,17.85
  Bottom 0.254: 54.12,13.66 54.12,10.51 v55.83,8.79 | 54.16,32.01 54.16,13.71 54.12,13.66 | v54.07,13.66 54.12,13.66 | 44.73,24.58 33.83,24.58 17.3,41.11 17.3,41.66 R2.2 16.26,42.7 R3.2 | v62.93,26.6 62.26,26.6 56.84,32.01 54.16,32.01 | 54.16,32.01 53.28,32.9 53.2,32.9 | 53.2,32.9 52.07,32.9 44.73,25.55 44.73,24.58 | 53.2,32.9 v53.2,39.14 | 44.73,24.58 v44.73,17.85
+5V
  Top 0.762: 55.75,53.62 56.38,53.62 57.05,52.96 C5.P$1 59.18,51.57 60.44,51.57 63.98,48.02 66.36,48.02 69.84,44.54 69.84,31.88 70.87,30.85 TP-5V.TP | 55.75,53.62 55.75,52.81 54.8,51.85 44.58,51.85 L1.1 | U4.4 55.75,53.62 | 81.18,27.66 79.12,29.72 TP-5V.TP | 69.46,27.18 69.48,27.16 69.48,26.6 C7.1 | 69.46,27.18 68.98,27.66 68.48,27.66 U7.4 | 69.46,27.18 70.87,28.58 TP-5V.TP | U12.4 81.18,27.66 | 81.18,27.66 81.64,27.66 82.44,26.87 82.44,26.6 C15.1 85.2,26.6 85.34,26.47 X1.1
GND  (via drill 0.61 pad 1.02)
  Top 0.254: v41.3,2.55 41.66,2.55 42.01,2.9 U10.3 43.83,2.04 48.52,2.04 49.38,2.9 U8.3 51.18,2.06 55.65,2.06 56.49,2.9 U9.3 | C20.1 73.29,4.89 72.9,5.29 U13.11 72.9,7.86 73.56,8.52 73.56,11.46 U13.3 73.56,13.69 73.55,13.7 C21.1 74.28,14.99 76.27,16.97 R12.2 80.52,18 84.84,22.32 | C13.2 52.72,10.23 40.47,10.23 38.19,12.5 26.61,12.5 25.78,11.67 B1.- 22.48,11.67 22.13,12.02 2.61,12.02 | 10.63,47.22 9.6,46.18 9.6,34.8 10.1,34.29 | 10.1,34.29 11.38,34.29 U2.2 | 10.1,34.29 10.1,32.13 6.42,28.45 5.8,28.45 4.65,27.29 4.65,27.18 CON1.6 3.56,26.09 3.44,26.09 2.43,25.07 2.43,13.04 2.61,12.87 2.61,12.02 | 10.63,47.22 14.04,47.22 14.45,47.62 U3.4 16.64,47.62 18.75,49.73 D3.AN | 14.08,54.81 10.63,51.36 10.63,47.22 | X2.P$1 9.93,60.32 11.08,59.17 11.08,57.82 14.08,54.81 | 14.08,54.81 D2.AN 16.8,56.55 20.45,56.55 | 48.49,23.04 51.75,23.04 U6.9 | 46.86,21.41 48.49,23.04 | 54.43,24.13 54.43,25.56 52.36,27.63 47.37,27.63 46.52,26.77 46.52,25.01 48.49,23.04 | 46.86,21.41 47.5,20.78 C11.2 48.63,19.75 48.63,15.75 49.65,14.73 U6.13 U6.14 | 46.86,21.41 37.47,21.41 U5.4 37.47,24.16 37.47,24.79 26,36.25 22.82,36.25 19.53,39.54 19.53,43.51 U1.2 | 54.43,24.13 54.82,24.13 59.39,24.13 60.34,23.18 60.34,22.77 | D5.P$1 54.43,24.13 | 20.45,56.55 20.45,61.58 23.88,65 LED1.K | 30.29,46.88 25.05,52.12 24.88,52.12 20.45,56.55 | 30.29,46.88 R15.1 R17.1 39.69,46.88 40.06,47.24 40.64,47.24 | 30.29,46.88 29.21,45.8 JP1.1 | 61.65,28.93 63.29,30.57 63.29,31.97 60.61,34.65 60.2,34.65 U15.2 60.2,35.97 60.3,35.97 61.24,36.9 61.24,38.94 60.2,39.98 U17.2 60.2,40.97 | U14.2 60.2,29.31 61.27,29.31 61.65,28.93
  Top 0.254: 63.38,24.7 61.65,26.44 61.65,28.93 | 40.64,47.24 41.13,47.73 56.36,47.73 58.37,45.72 U16.2 60.2,45.06 61.24,44.02 61.24,42.22 60.33,41.3 60.2,41.3 60.2,40.97 | 67.82,25.32 69.11,25.32 69.73,24.7 C7.2 C18.2 78.6,24.7 79.22,25.32 80.52,25.32 | 67.82,25.32 66.27,25.32 65.65,24.7 C14.2 63.38,24.7 | 67.82,25.32 67.82,25.2 U7.2 | 97.31,20.08 97.31,27.43 X1.4 89.43,33.47 89.43,38.89 85.02,43.3 82.8,43.3 80.64,45.47 71.55,45.47 61.06,55.96 60.12,55.96 | 97.31,20.08 97.31,14.29 97.72,13.88 X4.1 | 97.31,20.08 87.08,20.08 84.84,22.32 | 84.84,22.32 84.84,22.66 83.82,23.67 C15.2 82.69,24.7 82.07,25.32 80.52,25.32 | C8.1 60.44,16.02 60.34,16.12 60.34,21.52 C6.1 60.34,22.77 | 55.62,60.9 56.4,60.9 57.29,60.01 C1.2 59.74,60.01 60.19,59.56 | 60.12,55.96 60.19,56.02 60.19,59.56 | C5.P$2 60.12,55.96 | R19.1 40.64,47.24 | 36.58,7.39 36.58,7.59 R11.2 | 36.58,7.39 25.89,7.39 24.91,6.41 D7.P$1 D6.P$1 | 36.58,7.39 R9.2 37.62,6.35 38.48,7.21 42.01,7.21 42.49,7.21 U11.3 | X3.1 2.61,12.02 | 80.52,25.32 80.52,25.2 U12.2 | C2.2 60.19,59.56 | 60.34,22.77 61.45,22.77 63.38,24.7 | U4.6 54.48,60.73 55.45,60.73 55.62,60.9 | D4.A 55.62,60.9 | IC1.10 56.05,41.4 56.48,40.97 60.2,40.97
  Bottom 0.254: R9.2 37.62,6.35 37.62,6.23 v41.3,2.55 | R11.2 35.53,8.64 35.53,9.14 34.43,10.25 27.2,10.25 25.78,11.67 B1.-
  pour Top: 0,70.1 100.08,70.1 99.82,0 0,0
  pour Bottom: 0,70.1 99.82,70.1 99.82,0 0,0
N$1
  Bottom 0.762: X2.P$2 17.27,61.47 D1.A
N$2
  Top 0.254: U6.3 55.56,23.04 57.62,23.04 58.31,22.35 C6.2 59.04,20.18 Q2.1
N$3
  Top 0.254: CON1.3 7.19,24.64 7.19,25.32 U2.5 | U2.5
N$4  (via drill 0.61 pad 1.02)
  Top 0.254: U6.18 53.02,13.8 51.66,12.44 41.51,12.44 37.47,16.48 U5.5 37.47,18.54 37.47,19.23 32.98,23.72 v32.98,26.72 26.34,26.72 15.72,37.34 TP7.TP | v52.33,45.21 IC1.13
  Bottom 0.254: v32.98,26.72 34.98,26.72 51.44,43.18 51.44,44.32 v52.33,45.21
N$5
  Top 0.254: K1.4 86.01,65.53 90.68,60.86 X5.P$1
N$6
  Top 0.254: CON1.5 7.19,27.18 7.19,28.17 U2.4 | U2.4
N$7
  Top 0.254: IC1.21 46.49,38.86 46.49,40.76 52.91,47.19 55.93,47.19 59.79,43.33 60.2,43.33 U17.1
N$8
  Top 0.254: 13.25,33.78 U2.6 | U2.3 13.25,33.78 | 13.25,33.78 13.25,32.52 6.46,25.73 5.58,25.73 5,25.16 5,23.19 CON1.1
N$9  (via drill 0.61 pad 1.02)
  Top 0.254: K4.8 76.05,41.66 76.05,40.82 77.22,39.65 D11.A | v63.47,40.81 63.29,40.99 62.23,40.99 U17.3
  Bottom 0.254: v63.47,40.81 68.2,40.81 71.45,37.57 77.22,37.57 D11.A
N$10
  Top 0.254: C3.1 50.91,55.95 51.06,55.8 51.94,55.8 U4.1
N$11
  Top 0.762: 51.19,62.48 50.8,62.48 44.65,62.48 44.58,62.55 L1.2 | D4.C 51.19,62.48 | 51.19,59.36 50.01,59.36 49.78,59.13 C3.2 | U4.8 51.19,59.36 | 51.19,62.48 51.19,59.36
N$12
  Top 0.254: K4.4 86.01,49.28 87.56,50.82 X5.P$7
N$13
  Top 0.254: K4.3 86.01,46.74 87.09,47.82 X5.P$8
N$14  (via drill 0.61 pad 1.02)
  Top 0.254: U3.1 15.29,51.44 v14.05,50.2 | R2.1 11.18,40.61 11.18,37.05 11.85,36.37 13.56,36.37 14.98,34.96 U2.8
  Bottom 0.254: v14.05,50.2 14.05,45.57 11.18,42.7 R2.1
N$15
  Top 0.254: U5.2 40.01,25.78 Q1.2
N$16
  Top 0.254: U5.3 38.73,24.16 38.73,24.23 26.08,36.89 25.38,36.89 B1.+
N$17
  Top 0.254: U5.1 41.27,24.16 41.91,24.79 Q1.1
N$18
  Top 0.254: U14.1 60.2,31.34 59.54,31.34 56.93,28.74 52.11,28.74 45.8,35.05 IC1.24
N$19
  Top 0.254: IC1.23 46.49,36.32 46.49,35.62 52.85,29.25 56.61,29.25 58.8,31.44 58.8,35.44 60.03,36.68 60.2,36.68 U15.1
N$20
  Top 0.254: K1.3 86.01,62.99 89.48,59.52 89.48,55.02 X5.P$2
N$21  (via drill 0.61 pad 1.02)
  Top 0.254: U16.1 59.16,47.75 58.83,47.43 v57.92,47.43 | IC1.22 46.49,37.59 46.56,37.52 v50.67,37.52
  Bottom 0.254: v57.92,47.43 57.92,45.11 50.67,37.87 v50.67,37.52
N$22  (via drill 0.61 pad 1.02)
  Top 0.254: U14.3 62.23,31.65 61.92,31.96 v61.92,32.06 | K1.8 76.05,57.91 76.05,57.08 77.22,55.91 D8.A
  Bottom 0.254: D8.A 77.22,55.91 71.53,55.91 61.92,46.29 v61.92,32.06
N$23
  Top 0.254: K2.8 65.23,39.86 65.02,39.65 D9.A 65.02,37.57 64.52,37.57 63.27,36.32 U15.3
N$24  (via drill 0.61 pad 1.02)
  Top 0.254: K3.8 63.85,57.91 63.85,57.08 65.02,55.91 D10.A | U16.3 v62.23,47.92
  Bottom 0.254: D10.A 65.02,50.71 v62.23,47.92
N$26
  Top 0.254: 59.18,15.24 58.93,15.24
N$27  (via drill 0.61 pad 1.02)
  Top 0.254: 50.1,4.57 v50.1,5.16 | 50.1,4.57 50.1,4.22 U8.1 | 50.1,4.57 48.99,4.57 TP2.TP | U6.24 v58.45,13.11
  Bottom 0.254: v50.1,5.16 53.45,5.16 58.45,10.15 v58.45,13.11
N$28
  Top 0.254: U6.23 56.2,14.05 56.41,14.05 57.52,12.93 57.52,4.76 56.97,4.22 | 56.97,4.22 56.49,4.22 56.13,4.57 56.1,4.57 TP3.TP | U9.1 56.97,4.22
N$29
  Top 0.254: U8.2 47.86,3.56 47.6,3.82 46.86,3.82 46.6,3.56 U10.2 41.05,3.56 40.41,2.92 40.41,2.18 41.1,1.48 61.46,1.48 62.52,2.54 TP4.TP C16.1
N$30
  Top 0.254: U11.2 43.94,7.87 43.98,7.84 50.26,7.84 54.27,3.84 55.07,3.84 55.35,3.56 U9.2 57.94,3.56 58.42,3.56 61.5,3.56 62.52,4.57 TP5.TP 64.06,4.57 64.57,5.08 C17.2
N$31  (via drill 0.61 pad 1.02)
  Top 0.254: v47.23,2.93 45.91,2.93 45.87,2.9 U10.4 | v53.2,31.64 53.59,32.02 53.59,32.51 IC1.3 | v45.36,6.26 45.87,6.77 45.87,7.21 U11.4
  Bottom 0.254: 46.16,6.26 46.16,7.31 53.2,14.35 v53.2,31.64 | v45.36,6.26 46.16,6.26 | 46.16,6.26 46.16,4 v47.23,2.93
N$32
  Top 0.254: 58.27,15.75 53.85,15.75 53.66,15.56 U6.19 | 58.27,15.75 58.41,15.61 58.41,15.19 C8.2 | Q2.2 58.93,16.41 58.27,15.75
N$33  (via drill 0.61 pad 1.02)
  Top 0.254: U1.1 v18.89,44.15 | v48.14,41.15 48.32,41.15 53.59,35.88 53.59,35.05 IC1.5
  Bottom 0.254: v48.14,41.15 34.07,41.15 31.61,43.61 19.43,43.61 v18.89,44.15
N$35  (via drill 0.61 pad 1.02)
  Top 0.254: U6.15 51.12,14.37 50.79,14.05 49.04,14.05 v48.65,14.43 | v51.91,31.48 51.91,32.11 53.59,33.78 IC1.4
  Bottom 0.254: v51.91,31.48 51.91,17.7 v48.65,14.43
N$36
  Top 0.254: U11.1 42.01,8.53 40.26,8.53 37.62,11.18 R11.1 35.53,11.18 35.53,11.23 35.33,11.43 R10.2 28.43,11.43 24.91,7.91 D7.P$2 23.35,7.91 23.32,7.87 C10.2
N$37
  Top 0.254: U10.1 38.02,4.22 37.62,3.81 R9.1 35.53,3.81 35.45,3.73 33.42,3.73 33.25,3.56 | C9.2 23.32,3.05 23.35,3.02 23.35,3.01 D6.P$2 32.7,3.01 33.25,3.56 | R8.2 33.25,3.56
N$38  (via drill 0.61 pad 1.02)
  Top 0.254: v57.86,32.26 57.86,31.24 56.59,29.97 56.05,29.97 IC1.1 | U13.4 72.9,11.29 v72.66,11.05
  Bottom 0.254: v72.66,11.05 72.66,18.16 58.56,32.26 v57.86,32.26
N$39
  Bottom 0.254: R1.1 23.37,61.24 26.42,64.29 LED1.A
N$40
  Top 0.254: U13.2 74.19,13.69 75.01,14.5 86.72,14.5 X4.4
N$41  (via drill 0.61 pad 1.02)
  Top 0.254: IC1.15 v42.77,46.48 42.38,46.48 41.47,45.58 R19.2 | R18.1 41.47,42.31 41.62,42.46 v42.31,42.46
  Bottom 0.254: v42.31,42.46 42.77,42.91 v42.77,46.48
N$42
  Top 0.254: 39.45,44.81 43.62,44.81 44.03,45.21 IC1.16 | 39.45,44.81 39.41,44.85 38.86,44.85 R17.2 | 39.45,44.81 39.45,43.55 38.94,43.04 38.86,43.04 R16.1
N$43  (via drill 0.61 pad 1.02)
  Top 0.254: 37.08,43.94 R15.2 | R14.1 37.08,43.94 | 37.08,43.94 v38.56,43.94 | IC1.17 44.03,43.94 43.91,43.82 v41.85,43.82
  Bottom 0.254: v38.56,43.94 41.73,43.94 v41.85,43.82
N$44
  Top 0.254: U13.13 74.19,7.85 87.53,7.85 88.23,7.14 X4.3
N$45
  Top 0.254: R12.1 78.34,11.47 78.34,11.05 77.47,10.19 R13.2
N$46  (via drill 0.61 pad 1.02)
  Top 0.254: U13.12 73.56,5.61 73.6,5.57 v75.69,5.57
  Bottom 0.254: R13.1 76.43,6.6 76.43,6.31 v75.69,5.57
N$47
  Top 0.254: X3.2 7.6,6.63 9.14,5.08 R6.2
N$48
  Top 0.254: C9.1 19.36,3.05 19.33,3.07 19.33,5.08 R6.1
N$49
  Bottom 0.254: R7.2 15.75,9.17 12.1,12.82 12.1,16.23 X3.3
N$50
  Top 0.254: R7.1 19.33,8.13 19.33,7.9 19.36,7.87 C10.1
N$51
  Top 0.254: JP1.2 29.21,43.26 28.96,43.51 U1.7
N$52
  Top 0.254: K2.4 73.81,49.28 76.53,51.99 89.51,51.99 X5.P$3
N$53
  Top 0.254: U13.1 74.85,11.46 75.27,11.46 76.39,12.57 86.17,12.57 90.24,8.51 90.69,8.51 91.61,7.58 91.61,6.69 87.47,2.54 C16.2
N$54
  Top 0.254: C19.2 70.45,9 71.6,7.85 U13.9
N$55
  Top 0.254: U13.14 75.83,6.73 76.59,5.97 76.59,5.18 74.64,3.23 70.38,3.23 68.53,5.08 C17.1
N$56
  Top 0.254: C19.1 68.83,11.03 69.26,11.46 71.6,11.46 U13.6
N$57
  Top 0.254: U13.5 72.24,13.69 72.25,13.7 C21.2
N$58
  Top 0.254: C4.1 ANT.TP
N$59
  Top 0.254: U6.8 52.39,23.2 52.54,23.35 D5.P$2 52.54,25.26 52.47,25.33 C4.2
N$60
  Top 0.254: K2.3 73.81,46.74 74.7,47.62 85.55,47.62 86.9,48.97 89.53,48.97 X5.P$4
N$61
  Top 0.254: U6.22 55.56,13.88 56.28,13.16 56.39,13.16 C12.2
N$62  (via drill 0.61 pad 1.02)
  Top 0.254: U6.17 52.39,13.88 51.49,12.99 42.23,12.99 38.73,16.48 U5.6 38.73,19.23 35.51,22.45 v35.51,25.48 32.66,28.33 30.01,28.33 17.8,40.55 17.8,41.59 16.63,42.76 15.88,42.76 12.19,39.07 TP6.TP | v53.2,43.94 53.59,43.94 IC1.12
  Bottom 0.254: v35.51,25.48 53.2,43.17 v53.2,43.94
N$63
  Top 0.254: X5.P$5 87.68,57.68 86.06,59.3 83.25,59.3 77.89,64.65 74.7,64.65 73.81,65.53 K3.4
N$64
  Top 0.254: K3.3 73.81,62.99 74.7,62.11 79.05,62.11 82.37,58.79 85.84,58.79 86.47,58.16 86.47,56.31 87.68,55.11 X5.P$6
N$65
  Top 0.254: U2.1 12.14,34.96 10.1,36.99 10.1,42.34 11.18,43.41 R3.1 14.49,44.45 19.38,49.34 19.38,50.16 U3.7
N$66  (via drill 0.61 pad 1.02)
  Top 0.254: U8.4 53.24,2.9 53.29,2.95 v54.7,2.95 | U9.4 60.35,2.9 60.66,2.59 v60.73,2.59 | v56.48,31.12 56.17,31.12 56.05,31.24 IC1.2
  Bottom 0.254: 60,2.95 v54.7,2.95 | v60.73,2.59 60.38,2.95 60,2.95 | 60,2.95 60,27.6 v56.48,31.12
SCL_LONG
  Top 0.254: 22.12,48.26 22.12,48.9 U3.6 | 22.12,48.26 22.12,47.62 U3.5 | 22.12,48.26 23.85,48.26 R5.1 | D3.KAT 17.61,58.85 17.22,58.47 X2.P$4
  Bottom 0.254: R5.1 23.85,48.26 13.64,58.47 X2.P$4
SDA_LONG
  Top 0.254: R4.1 12.73,48.26 13.36,48.9 U3.3 17.2,48.9 17.2,50.16 U3.2 | D2.KAT 10.74,55.95 9.93,56.77 X2.P$3
  Bottom 0.254: R4.1 11.68,49.3 9.93,51.06 X2.P$3
VCC
  Top 0.762: 53.62,63.48 51.49,65.61 37.69,65.61 32.28,60.2 R1.2 | 53.62,63.48 53.62,63.95 54.7,65.04 56.58,65.04 58.42,63.2 58.42,62.55 | 83.81,41.66 84.84,40.63 D11.C | 83.81,41.66 82.99,41.66 81.86,42.79 75.2,42.79 74.07,41.66 | K4.1 83.81,41.66 | D10.C 72.64,56.16 71.82,56.98 71.82,57.91 | 71.82,57.91 68.15,61.59 63.78,61.59 63,62.36 C2.1 59.93,62.36 59.74,62.55 58.42,62.55 | 72.03,57.91 71.82,57.91 | C1.1 58.42,62.55 | U4.7 53.21,63.08 53.62,63.48 | 72.03,57.91 73.16,59.05 78.76,59.05 79.9,57.91 K1.1 84.84,57.7 D8.C | K3.1 72.03,57.91 | D9.C 72.64,39.9 73.09,39.9 74.07,40.88 74.07,41.66 | K2.1 74.07,41.66 | R5.2 23.6,50.8 23.6,52.01 19.84,55.77 17.71,55.77 16.3,54.35 16.3,53.71 14.94,52.35 14.53,52.35 12.98,50.8 R4.2
  Bottom 0.762: D10.C D9.C | 32.14,56.76 26.19,50.8 R5.2 | 32.14,56.76 32.14,57.75 30.99,58.9 R1.2 | 32.14,56.76 | D1.C 32.14,56.76